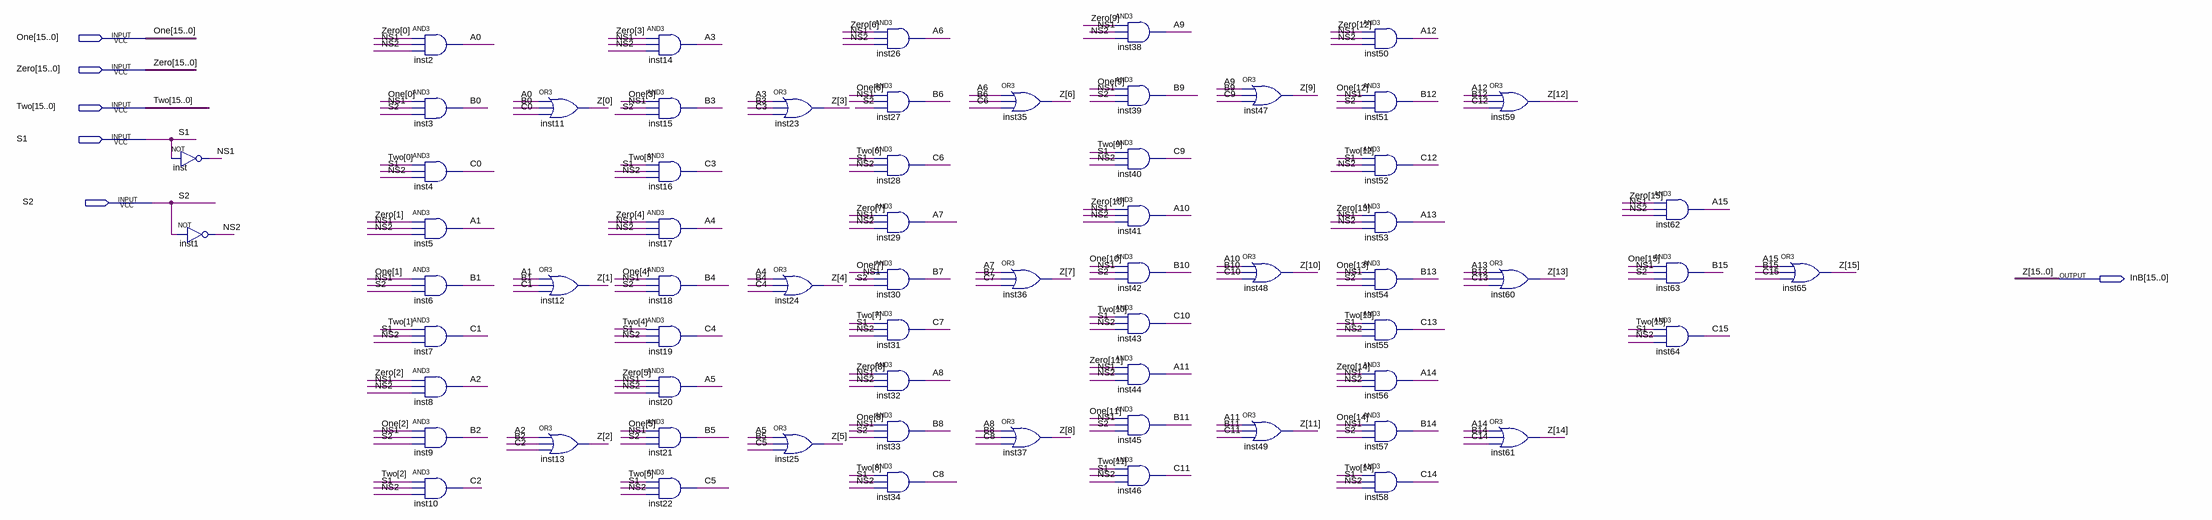
[diagram p0: schematic sheet]
// Quartus schematic SixteenThreeToOneMux.bdf as structural Verilog: 66 symbols, 6 pins
module SixteenThreeToOneMux (
  input  [15:0] One,
  input  [15:0] Zero,
  input  [15:0] Two,
  input  S1,
  input  S2,
  output [15:0] InB
);

  wire A0, A1, A2, A3, A4, A5, A6, A7, A8, A9, A10, A11, A12, A13, A14, A15, B0, B1, B2, B3, B4, B5, B6, B7,
       B8, B9, B10, B11, B12, B13, B14, B15, C0, C1, C2, C3, C4, C5, C6, C7, C8, C9, C10, C11, C12, C13, C14,
       C15, NS1, NS2;

  not inst (NS1, S1);
  not inst1 (NS2, S2);
  and inst2 (A0, Zero[0], NS1, NS2);
  and inst3 (B0, One[0], NS1, S2);
  and inst4 (C0, Two[0], S1, NS2);
  and inst5 (A1, Zero[1], NS1, NS2);
  and inst6 (B1, One[1], NS1, S2);
  and inst7 (C1, Two[1], S1, NS2);
  and inst8 (A2, Zero[2], NS1, NS2);
  and inst9 (B2, One[2], NS1, S2);
  and inst10 (C2, Two[2], S1, NS2);
  or inst11 (InB[0], A0, B0, C0);
  or inst12 (InB[1], A1, B1, C1);
  or inst13 (InB[2], A2, B2, C2);
  and inst14 (A3, Zero[3], NS1, NS2);
  and inst15 (B3, One[3], NS1, S2);
  and inst16 (C3, Two[3], S1, NS2);
  and inst17 (A4, Zero[4], NS1, NS2);
  and inst18 (B4, One[4], NS1, S2);
  and inst19 (C4, Two[4], S1, NS2);
  and inst20 (A5, Zero[5], NS1, NS2);
  and inst21 (B5, One[5], NS1, S2);
  and inst22 (C5, Two[5], S1, NS2);
  or inst23 (InB[3], A3, B3, C3);
  or inst24 (InB[4], A4, B4, C4);
  or inst25 (InB[5], A5, B5, C5);
  and inst26 (A6, Zero[6], NS1, NS2);
  and inst27 (B6, One[6], NS1, S2);
  and inst28 (C6, Two[6], S1, NS2);
  and inst29 (A7, Zero[7], NS1, NS2);
  and inst30 (B7, One[7], NS1, S2);
  and inst31 (C7, Two[7], S1, NS2);
  and inst32 (A8, Zero[8], NS1, NS2);
  and inst33 (B8, One[8], NS1, S2);
  and inst34 (C8, Two[8], S1, NS2);
  or inst35 (InB[6], A6, B6, C6);
  or inst36 (InB[7], A7, B7, C7);
  or inst37 (InB[8], A8, B8, C8);
  and inst38 (A9, Zero[9], NS1, NS2);
  and inst39 (B9, One[9], NS1, S2);
  and inst40 (C9, Two[9], S1, NS2);
  and inst41 (A10, Zero[10], NS1, NS2);
  and inst42 (B10, One[10], NS1, S2);
  and inst43 (C10, Two[10], S1, NS2);
  and inst44 (A11, Zero[11], NS1, NS2);
  and inst45 (B11, One[11], NS1, S2);
  and inst46 (C11, Two[11], S1, NS2);
  or inst47 (InB[9], A9, B9, C9);
  or inst48 (InB[10], A10, B10, C10);
  or inst49 (InB[11], A11, B11, C11);
  and inst50 (A12, Zero[12], NS1, NS2);
  and inst51 (B12, One[12], NS1, S2);
  and inst52 (C12, Two[12], S1, NS2);
  and inst53 (A13, Zero[13], NS1, NS2);
  and inst54 (B13, One[13], NS1, S2);
  and inst55 (C13, Two[13], S1, NS2);
  and inst56 (A14, Zero[14], NS1, NS2);
  and inst57 (B14, One[14], NS1, S2);
  and inst58 (C14, Two[14], S1, NS2);
  or inst59 (InB[12], A12, B12, C12);
  or inst60 (InB[13], A13, B13, C13);
  or inst61 (InB[14], A14, B14, C14);
  and inst62 (A15, Zero[15], NS1, NS2);
  and inst63 (B15, One[15], NS1, S2);
  and inst64 (C15, Two[15], S1, NS2);
  or inst65 (InB[15], A15, B15, C15);

  // Other names for the same wires on the sheet: Z[15:0] = InB
endmodule
